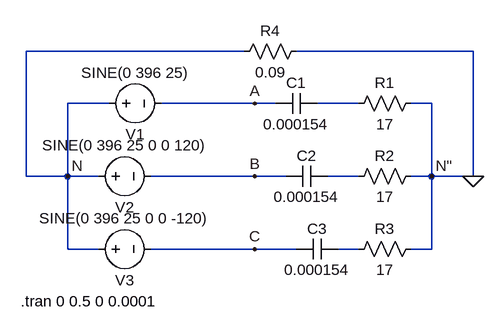
[diagram p0: schematic Draft1.asc]
Draft1.asc, the LTspice schematic file:
Version 4
SHEET 1 880 680
WIRE 416 0 80 0
WIRE 768 0 496 0
WIRE 208 80 144 80
WIRE 432 80 288 80
WIRE 464 80 432 80
WIRE 592 80 528 80
WIRE 704 80 672 80
WIRE 80 192 80 0
WIRE 144 192 144 80
WIRE 144 192 80 192
WIRE 192 192 144 192
WIRE 432 192 272 192
WIRE 480 192 432 192
WIRE 592 192 544 192
WIRE 704 192 704 80
WIRE 704 192 672 192
WIRE 768 192 768 0
WIRE 768 192 704 192
WIRE 144 304 144 192
WIRE 192 304 144 304
WIRE 432 304 272 304
WIRE 496 304 432 304
WIRE 592 304 560 304
WIRE 704 304 704 192
WIRE 704 304 672 304
FLAG 144 192 N
FLAG 704 192 N"
FLAG 768 192 0
FLAG 432 80 A
FLAG 432 192 B
FLAG 432 304 C
SYMBOL res 688 176 R90
WINDOW 0 0 56 VBottom 2
WINDOW 3 32 56 VTop 2
SYMATTR InstName R2
SYMATTR Value 17
SYMBOL res 688 288 R90
WINDOW 0 0 56 VBottom 2
WINDOW 3 32 56 VTop 2
SYMATTR InstName R3
SYMATTR Value 17
SYMBOL voltage 192 80 R270
WINDOW 0 -32 56 VBottom 2
WINDOW 3 32 56 VTop 2
WINDOW 123 0 0 Left 0
WINDOW 39 0 0 Left 0
SYMATTR InstName V1
SYMATTR Value SINE(0 396 25)
SYMBOL voltage 176 192 R270
WINDOW 0 -32 56 VBottom 2
WINDOW 3 32 56 VTop 2
WINDOW 123 0 0 Left 0
WINDOW 39 0 0 Left 0
SYMATTR InstName V2
SYMATTR Value SINE(0 396 25 0 0 120)
SYMBOL voltage 176 304 R270
WINDOW 0 -32 56 VBottom 2
WINDOW 3 32 56 VTop 2
WINDOW 123 0 0 Left 0
WINDOW 39 0 0 Left 0
SYMATTR InstName V3
SYMATTR Value SINE(0 396 25 0 0 -120)
SYMBOL cap 544 176 R90
WINDOW 0 0 32 VBottom 2
WINDOW 3 32 32 VTop 2
SYMATTR InstName C2
SYMATTR Value 0.000154
SYMBOL cap 560 288 R90
WINDOW 0 0 32 VBottom 2
WINDOW 3 32 32 VTop 2
SYMATTR InstName C3
SYMATTR Value 0.000154
SYMBOL cap 528 64 R90
WINDOW 0 0 32 VBottom 2
WINDOW 3 32 32 VTop 2
SYMATTR InstName C1
SYMATTR Value 0.000154
SYMBOL res 688 64 R90
WINDOW 0 0 56 VBottom 2
WINDOW 3 32 56 VTop 2
SYMATTR InstName R1
SYMATTR Value 17
SYMBOL res 512 -16 R90
WINDOW 0 0 56 VBottom 2
WINDOW 3 32 56 VTop 2
SYMATTR InstName R4
SYMATTR Value 0.09
TEXT 72 384 Left 2 !.tran 0 0.5 0 0.0001

The netlist it stands for:
* Draft1.asc
R2 0 N002 17
R3 0 N003 17
V1 N A SINE(0 396 25)
V2 N B SINE(0 396 25 0 0 120)
V3 N C SINE(0 396 25 0 0 -120)
C2 N002 B 0.000154
C3 N003 C 0.000154
C1 N001 A 0.000154
R1 0 N001 17
R4 0 N 0.09
.tran 0 0.5 0 0.0001
.backanno
.end

* Results of the author's LTspice run, read from the files saved beside the schematic
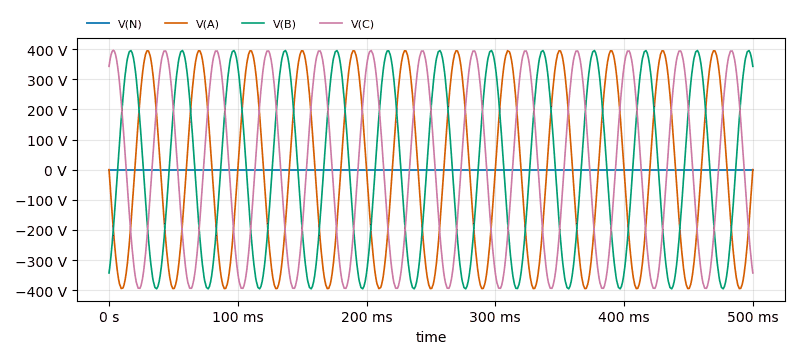
[diagram p1: Transient Analysis of Draft1.asc, plotted from the saved traces]
* Transient Analysis, 1 run:
*   V(N): min -1.855 pV, max 3.09 pV, average 0.5777 fV, rms 28.26 fV, last -14.8 fV
*   V(A): min -395 V, max 395 V, average -10.07 V, rms 280 V, last 0 V
*   V(B): min -395.5 V, max 395.5 V, average 5.024 V, rms 280 V, last 342.9 V
*   V(C): min -393.8 V, max 396 V, average 5.043 V, rms 280 V, last -342.9 V